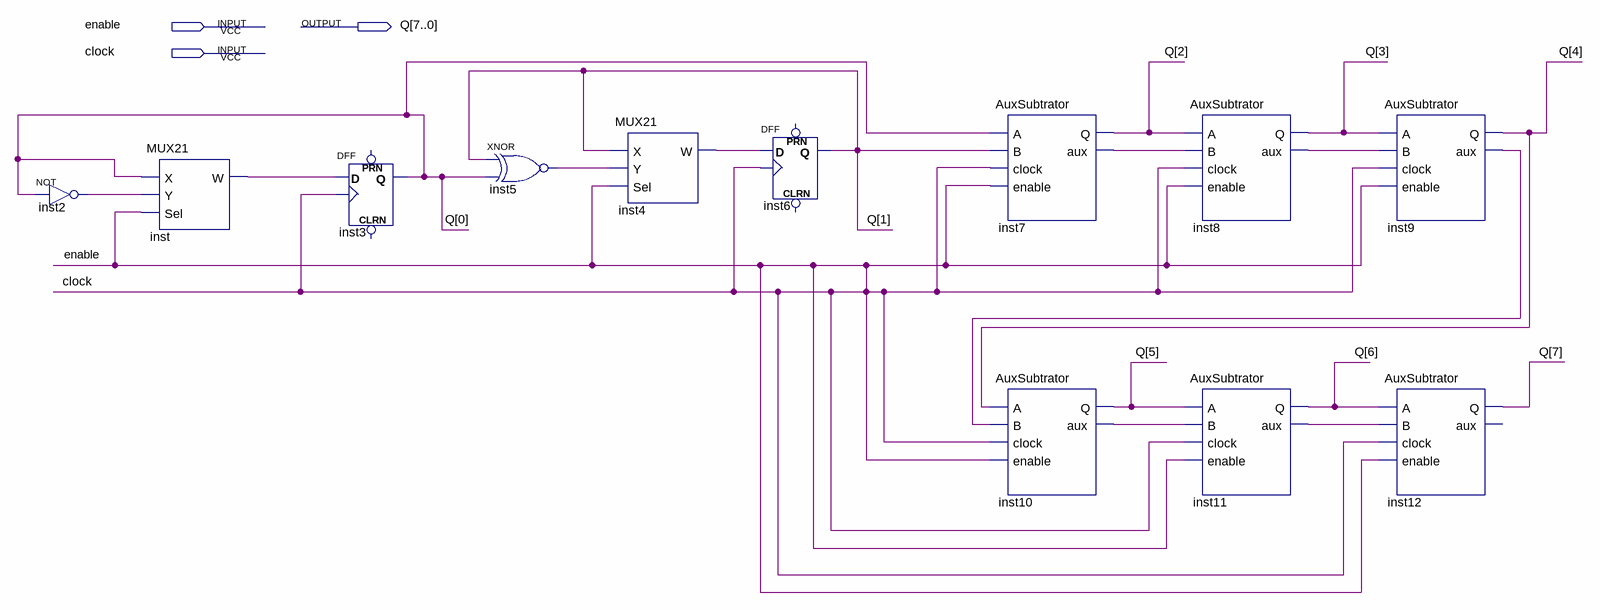
[diagram p0: schematic sheet]
// Quartus schematic Subtrator.bdf as structural Verilog: 12 symbols, 3 pins
module Subtrator (
  input  enable,
  input  clock,
  output [7:0] Q
);

  wire inst2_out, inst4_w, inst5_out, inst7_aux, inst8_aux, inst9_aux, inst10_aux, inst11_aux, inst_w;

  not inst2 (inst2_out, Q[0]);
  MUX21 inst (.X(Q[0]), .Y(inst2_out), .Sel(clock), .W(inst_w));
  DFF inst3 (.CLK(clock), .D(inst_w), .Q(Q[0]));  // open: CLRN, PRN
  xnor inst5 (inst5_out, Q[1], Q[0]);
  MUX21 inst4 (.X(Q[1]), .Y(inst5_out), .Sel(clock), .W(inst4_w));
  DFF inst6 (.CLK(clock), .D(inst4_w), .Q(Q[1]));  // open: CLRN, PRN
  AuxSubtrator inst7 (.A(Q[0]), .B(Q[1]), .clock(clock), .enable(clock), .Q(Q[2]), .aux(inst7_aux));
  AuxSubtrator inst10 (.A(Q[4]), .B(inst9_aux), .clock(clock), .enable(clock), .Q(Q[5]), .aux(inst10_aux));
  AuxSubtrator inst8 (.A(Q[2]), .B(inst7_aux), .clock(clock), .enable(clock), .Q(Q[3]), .aux(inst8_aux));
  AuxSubtrator inst11 (.A(Q[5]), .B(inst10_aux), .clock(clock), .enable(clock), .Q(Q[6]), .aux(inst11_aux));
  AuxSubtrator inst9 (.A(Q[3]), .B(inst8_aux), .clock(clock), .enable(clock), .Q(Q[4]), .aux(inst9_aux));
  AuxSubtrator inst12 (.A(Q[6]), .B(inst11_aux), .clock(clock), .enable(clock), .Q(Q[7]));  // open: aux

  assign enable = clock;
endmodule
